# EAGLE design tattooboard (EAGLE 9.5.0)
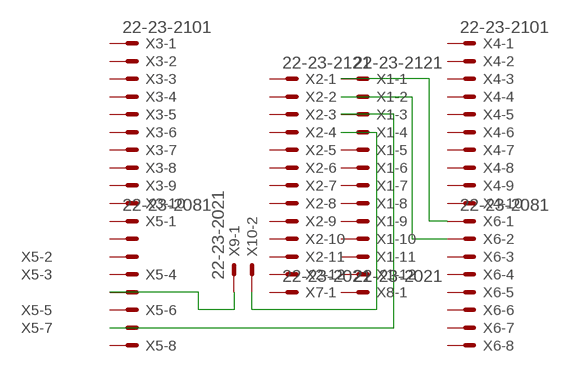
[diagram p0: schematic, sheet 1]

## Parts
X1  22-23-2121  [22-23-2121]
X2  22-23-2121  [22-23-2121]
X3  22-23-2101  [22-23-2101]
X4  22-23-2101  [22-23-2101]
X5  22-23-2081  [22-23-2081]
X6  22-23-2081  [22-23-2081]
X7  22-23-2021  [22-23-2021]
X8  22-23-2021  [22-23-2021]
X9  22-23-2021  [22-23-2021]
X10  22-23-2021  [22-23-2021]

## Nets
N$1: X1.2 X6.2
N$2: X5.5 X9.1
N$3: X1.1 X6.1
N$4: X1.3 X5.7
N$5: X1.4 X10.2
Unconnected: X1.5 X1.6 X1.7 X1.8 X1.9 X1.10 X1.11 X1.12 X2.1 X2.2 X2.3 X2.4 X2.5 X2.6 X2.7 X2.8 X2.9 X2.10 X2.11 X2.12 X3.1 X3.2 X3.3 X3.4 X3.5 X3.6 X3.7 X3.8 X3.9 X3.10 X4.1 X4.2 X4.3 X4.4 X4.5 X4.6 X4.7 X4.8 X4.9 X4.10 X5.1 X5.2 X5.3 X5.4 X5.6 X5.8 X6.3 X6.4 X6.5 X6.6 X6.7 X6.8 X7.1 X7.2 X8.1 X8.2 X9.2 X10.1

## Library data of the parts
X1 X2 = con-molex:22-23-2121: .100" (2.54mm) Center Header - 12 Pin; MF: MOLEX; MPN: 22-23-2121; OC_FARNELL: 1462935; OC_NEWARK: 56H0456
X3 X4 = con-molex:22-23-2101: .100" (2.54mm) Center Header - 10 Pin; MF: MOLEX; MPN: 22-23-2101; OC_FARNELL: 1756828; OC_NEWARK: 94C0765
X5 X6 = con-molex:22-23-2081: .100" (2.54mm) Center Header - 8 Pin; MF: MOLEX; MPN: 22-23-2081; OC_FARNELL: 1756826; OC_NEWARK: 01C7592
X7-X10 = con-molex:22-23-2021: .100" (2.54mm) Center Header - 2 Pin; MF: MOLEX; MPN: 22-23-2021; OC_FARNELL: 1462926; OC_NEWARK: 25C3832

## Board
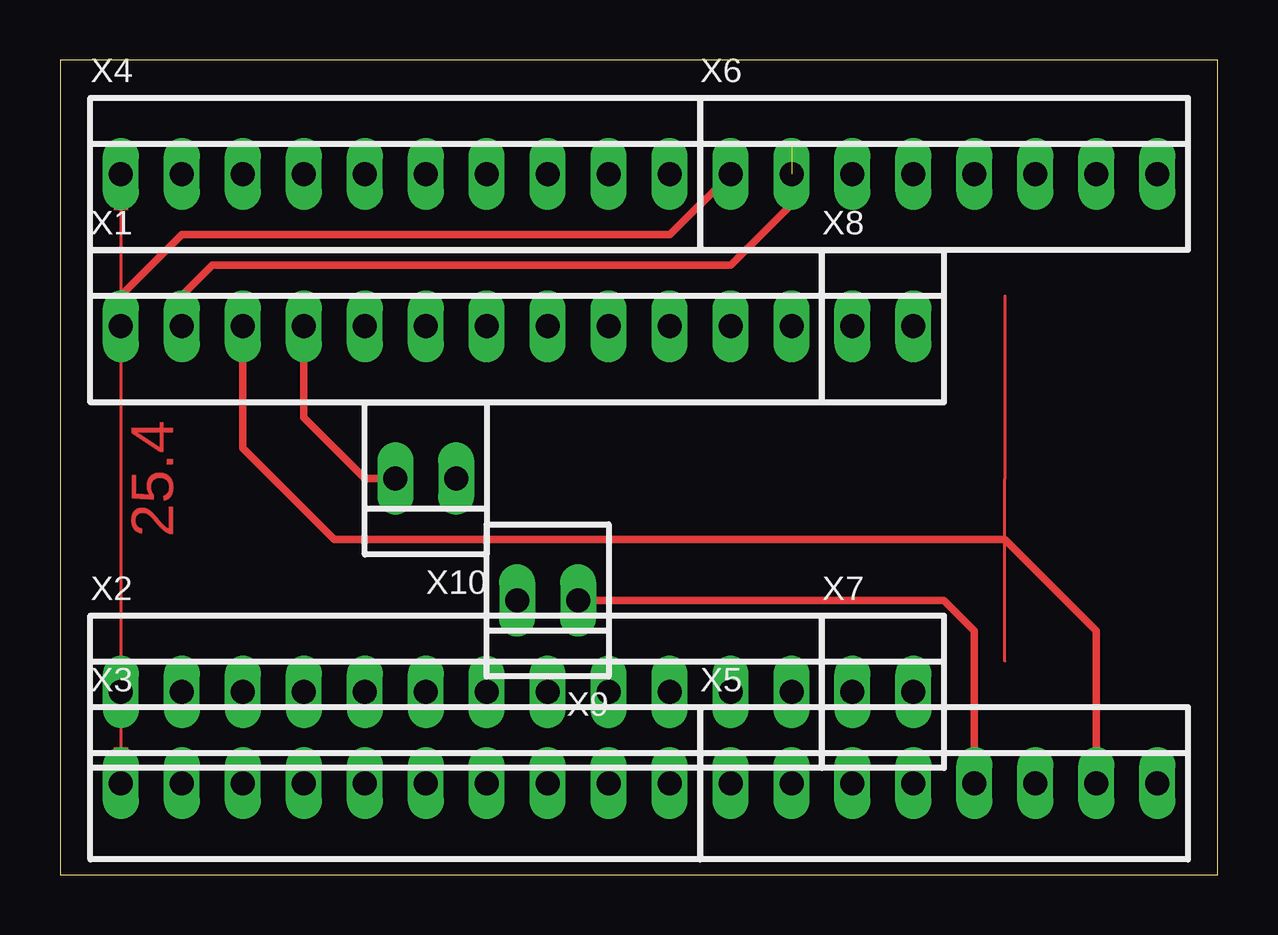
[diagram p1: board, top side]

Size 48.24 x 33.96 mm. Coordinates in mm from the lower left corner, seen from the top.
Outline: 0,0 48.24,0 48.24,33.96 0,33.96 0,0
Copper layers (1*16): Top 0.035mm / dielectric 1.5mm / Bottom 0.035mm
Design rules "default": minimum track width 6mil, minimum drill 0.35mm, track to track 6mil, track to pad 6mil, pad to pad 6mil, via to via 6mil, smd to smd 6mil, copper to edge 40mil, drill to drill 6mil, minimum pad ring 10mil, minimum via ring 8mil, stop-mask expansion 4mil, vias tented up to drill 0mil, thermal gap 10mil

### Footprints (pad centres in the part's own frame; a part is rotated, then mirrored left to right if it is on the bottom)
22-23-2121 = drill 1 long: 1 -13.97,0; 2 -11.43,0; 3 -8.89,0; 4 -6.35,0; 5 -3.81,0; 6 -1.27,0; 7 1.27,0; 8 3.81,0; 9 6.35,0; 10 8.89,0; 11 11.43,0; 12 13.97,0
22-23-2101 = drill 1 long: 1 -11.43,0; 2 -8.89,0; 3 -6.35,0; 4 -3.81,0; 5 -1.27,0; 6 1.27,0; 7 3.81,0; 8 6.35,0; 9 8.89,0; 10 11.43,0
22-23-2081 = drill 1 long: 1 -8.89,0; 2 -6.35,0; 3 -3.81,0; 4 -1.27,0; 5 1.27,0; 6 3.81,0; 7 6.35,0; 8 8.89,0
22-23-2021 = drill 1 long: 1 -1.27,0; 2 1.27,0

### Placement (x,y rotation side)
X1  16.51,22.86 0 top
X2  16.51,7.62 0 top
X3  13.97,3.81 0 top
X4  13.97,29.21 0 top
X5  36.83,3.81 0 top
X6  36.83,29.21 0 top
X7  34.29,7.62 0 top
X8  34.29,22.86 0 top
X9  20.32,11.43 180 top
X10  15.24,16.51 180 top

### Tracks (layer width: path | path; a pad name or v marks a point on that pad's centre or on a via)
N$1  (1 unrouted)
  Top 0.305: X1.2 5.08,24.13 6.35,25.4 27.94,25.4 30.48,27.94 30.48,30.48
N$2
  Top 0.305: X9.1 36.83,11.43 38.1,10.16 X5.5
N$3
  Top 0.152: X1.1 2.54,24.13
  Top 0.305: X6.1 25.4,26.67 5.08,26.67 2.54,24.13
N$4
  Top 0.305: X1.3 7.62,17.78 11.43,13.97 39.37,13.97 43.18,10.16 X5.7
N$5
  Top 0.305: X1.4 10.16,19.05 12.7,16.51 X10.2
(copper drawn outside any net)
  shapes: Top area x2